# Altium project lather_front_panel.PrjPcb
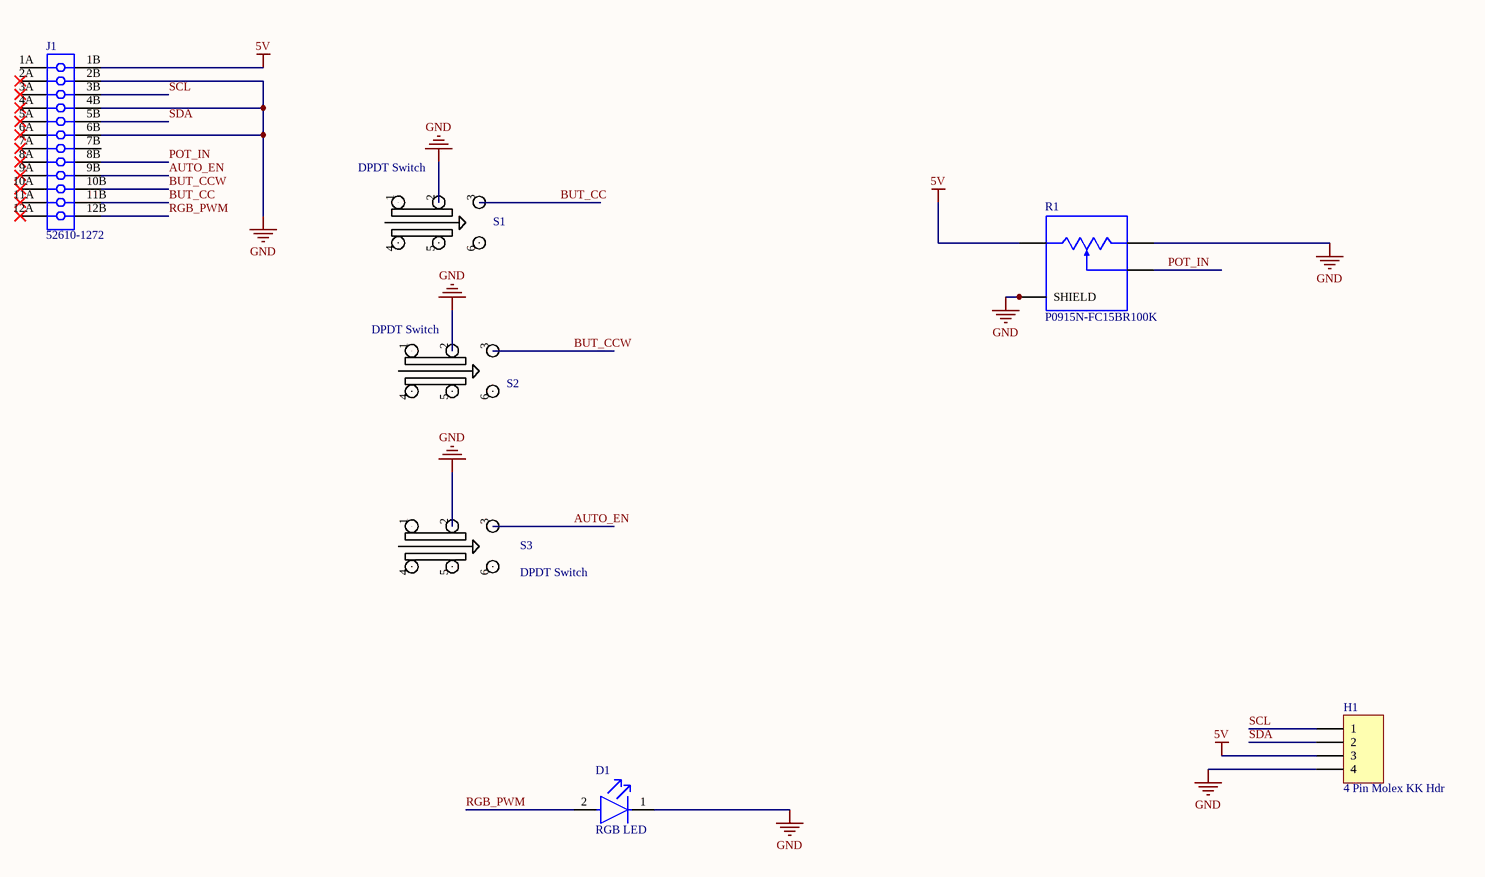
[diagram p0: lather_front_panel.SchDoc]
1 sheet, 7 parts. Net scope: global (net labels, ports and power ports of the same name join across sheets).
Board file: lather_front_panel.PcbDoc

## Sheet lather_front_panel.SchDoc
size A3; SheetNumber: 1; SheetTotal: 1

### Parts
D1  RGB LED  [INDRD500W70D900H1220]
H1  4 Pin Molex KK Hdr  [MOLEX_KK_4_HDR]
J1  52610-1272  [MOLX-52610-1272]
R1  P0915N-FC15BR100K  [TRIM_P0915N-FC15BR100K]
S1  DPDT Switch  [TL2230EEF100]
S2  DPDT Switch  [TL2230EEF100]
S3  DPDT Switch  [TL2230EEF100]

### Nets
5V: H1.3 J1.1B R1.1
GND: D1.1(C) H1.4 J1.2B J1.4B J1.6B R1.3 R1.S1(SHIELD) R1.S2(SHIELD) S1.2 S2.2 S3.2
AUTO_EN: J1.9B S3.3
BUT_CC: J1.11B S1.3
BUT_CCW: J1.10B S2.3
POT_IN: J1.8B R1.2
RGB_PWM: D1.2(A) J1.12B
SCL: H1.1 J1.3B
SDA: H1.2 J1.5B

Not connected (* = marked no-connect by the designer): J1 1A 2A* 3A* 4A* 5A* 6A* 7A* 7B 8A* 9A* 10A* 11A* 12A*; S1 1 4 5 6; S2 1 4 5 6; S3 1 4 5 6

### Library data of the parts
H1 = JA_MOLEX_KK_4POS: CONN HEADER 4POS 2.54mm VERT_Thru Hole; Manufacturer: Molex; Manufacturer PN: 22-23-2041; Supplier Part Number 1: 9731164; Supplier: ECE Dept; Supplier 1: Farnell; Storage Location: ECE Dept Store; Value: 4 Pin Molex KK Hdr
J1 = CMP-1241-00323-1: 1.0 mm Pitch Easy-On(TM) Type FPC Connector, 5.75 mm Mated Height, Vertical, ZIF, SMT, 12 Circuits, -40 to 85 degC, ELV and RoHS Compliant, Tape and Reel; Manufacturer: Molex; PCB Retention: None; Material - Metal: Phosphor Bronze; PCB Locator: No; Current (Max per Contact): 1A; Material - Plating Mating: Gold; Circuits (Loaded): 12; Material - Plating Termination: Tin; Pitch - Mating Interface: 1.00mm; Mated Height: 5.75mm; Durability (mating cycles max): 30; Voltage (Max): 125V AC (RMS)/DC; ComponentLink2URL: http://www.molex.com/webdocs/datasheets/pdf/en-us/0526101272_FFC_FPC_CONNECTORS.pdf; Orientation: Vertical; PackageDescription: 12-Lead FPC Connector, Pitch 1.0 mm; ComponentLink2Description: Datasheet; Polarized to PCB: No; ComponentLink1Description: Manufacturer URL; Entry Angle: Vertical; PartNumber: 52610-1272; PackageReference: 52610-1272; Contact Position: N/A; Mounting Technology: Surface Mount; Stackable: No; ComponentLink3URL: http://www.molex.com/pdm_docs/sd/526101272_sd.pdf; ComponentLink1URL: http://www.molex.com/molex/index.jsp; Number of Rows: 1; RoHS: TRUE; PackageVersion: Rev. G, 02/2012; Packing: Tape and Reel; ComponentLink3Description: Package Specification
R1 = P0915N-FC15BR100K: 100k Ohm 1 Gang Linear Panel Mount Potentiometer None 1 Kierros Conductive Plastic 0.05W, 1/20W PC Pins, Board Locks; MF: TT Electronics/BI; Check_prices: https://www.snapeda.com/parts/P0915N-FC15BR100K/TT%20Electronics/BI/view-part/1438723/?ref=eda; Price: None; Availability: Warning; SnapEDA_Link: https://www.snapeda.com/parts/P0915N-FC15BR100K/TT%20Electronics/BI/view-part/1438723/?ref=snap; Value: *; Package: None; MP: P0915N-FC15BR100K; Purchase-URL: https://pricing.snapeda.com/search/part/P0915N-FC15BR100K/?ref=eda
S1-S3 = TL2230EEF100